# EAGLE design tian_light_rgb_revc (EAGLE 6.1)
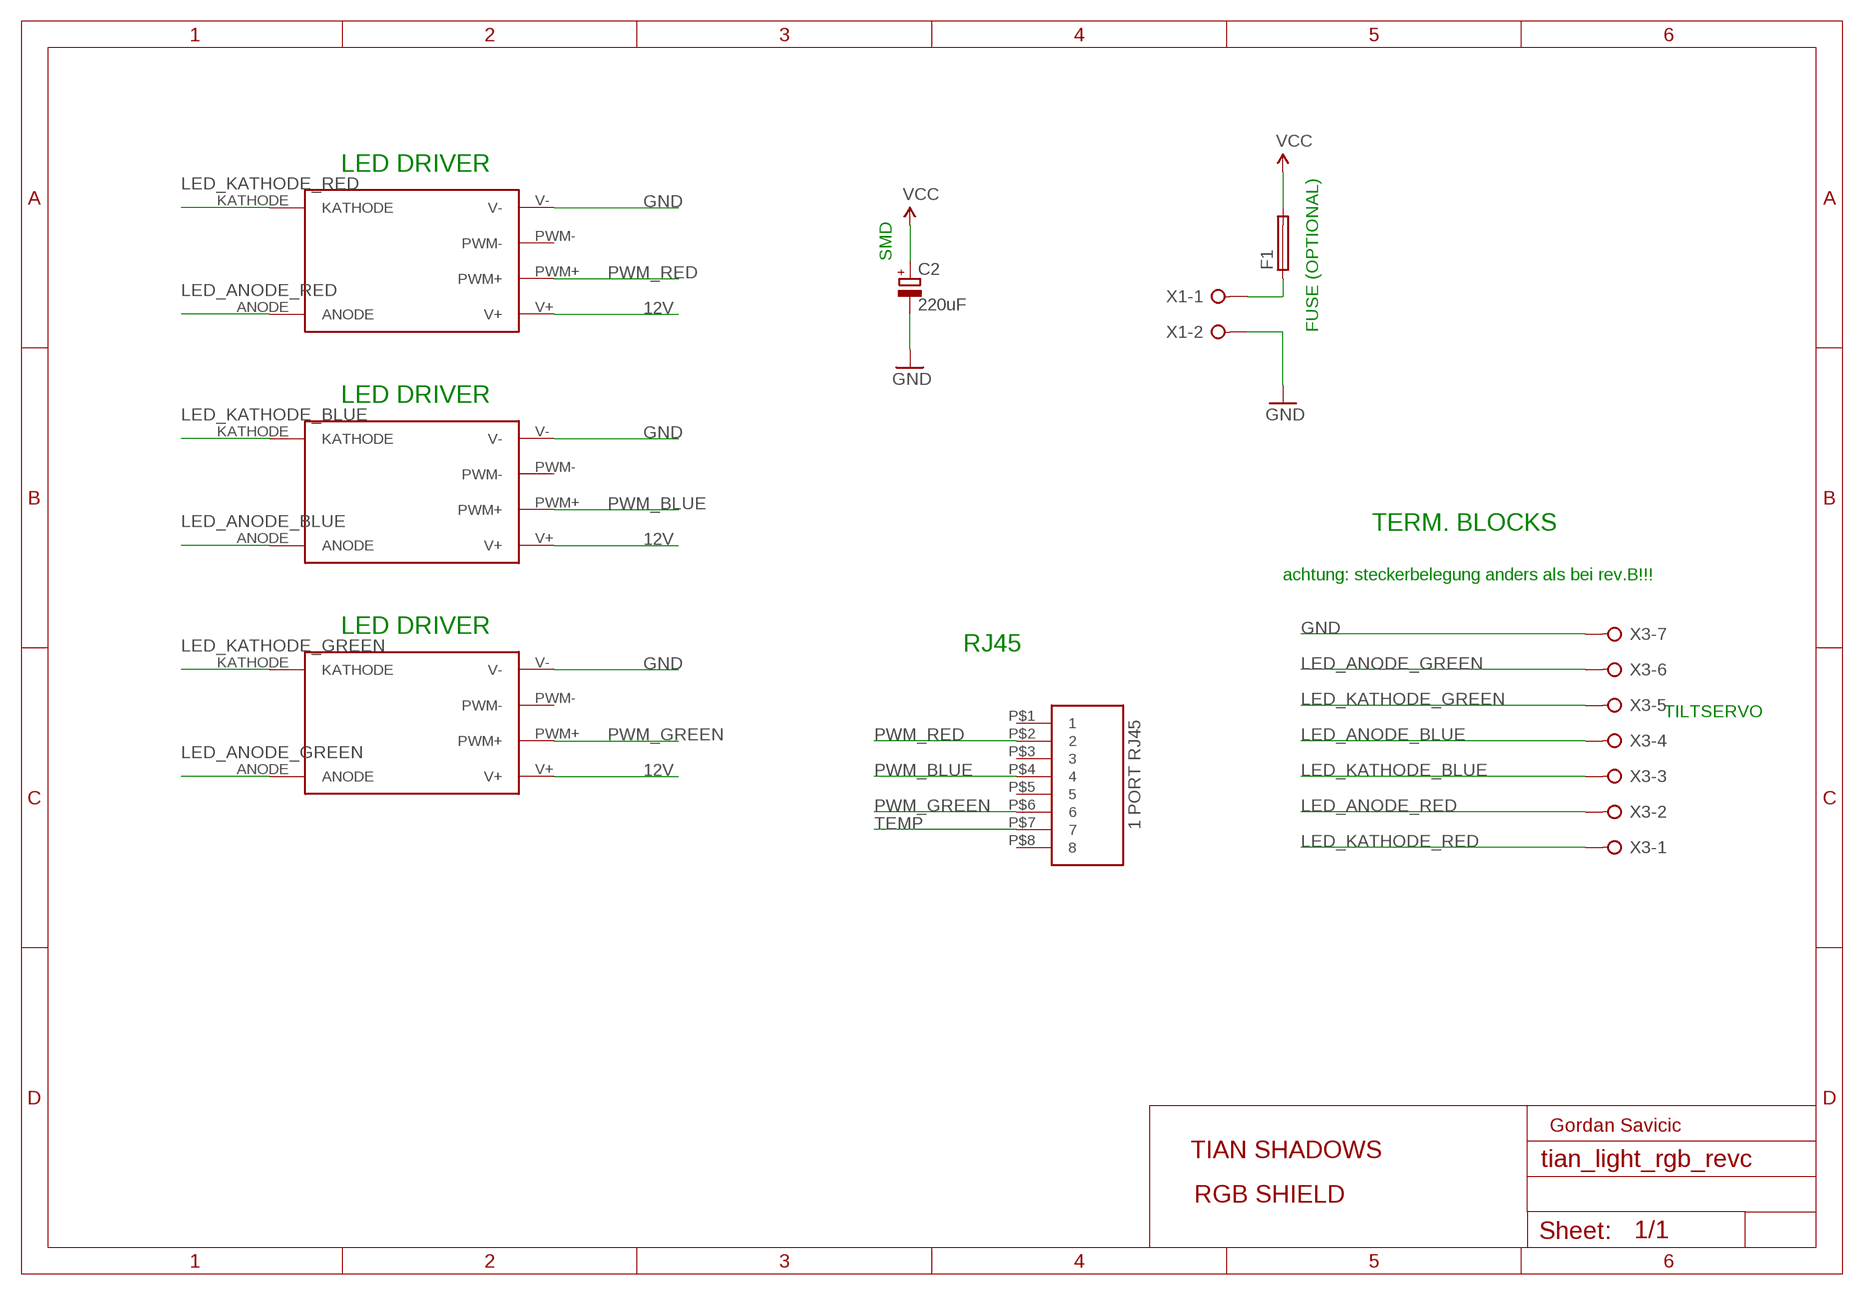
[diagram p0: schematic, sheet 1]

## Parts
C2  220uF  CPOL-EUF  [PANASONIC_F]
F1  SH22,5  [SH22,5]
U$1  BUCK_LED_DRIVER  [BUCK_LED_DRIVER]
U$2  BUCK_LED_DRIVER  [BUCK_LED_DRIVER]
U$3  BUCK_LED_DRIVER  [BUCK_LED_DRIVER]
U$5  1PORT_ETHERNET  [1PORT_ETHERNET]
X1  W237-02P  [W237-132]
X3  W237-07P  [W237-7P]

## Nets
12V: C2.+ F1.2 U$1.V+ U$2.V+ U$3.V+ ; supply symbol labelled VCC
GND: C2.- U$1.V- U$2.V- U$3.V- X1.2 X3.7
LED_ANODE_BLUE: U$2.ANODE X3.4
LED_ANODE_GREEN: U$3.ANODE X3.6
LED_ANODE_RED: U$1.ANODE X3.2
LED_KATHODE_BLUE: U$2.KATHODE X3.3
LED_KATHODE_GREEN: U$3.KATHODE X3.5
LED_KATHODE_RED: U$1.KATHODE X3.1
N$1: F1.1 X1.1
PWM_BLUE: U$2.PWM+ U$5.P$4
PWM_GREEN: U$3.PWM+ U$5.P$6
PWM_RED: U$1.PWM+ U$5.P$2
TEMP: U$5.P$7
Unconnected: U$1.PWM- U$2.PWM- U$3.PWM- U$5.P$1 U$5.P$3 U$5.P$5 U$5.P$8

## Notes on the sheet
- LED DRIVER
- SMD
- FUSE (OPTIONAL)
- LED DRIVER
- TERM. BLOCKS
- achtung: steckerbelegung anders als bei rev.B!!!
- LED DRIVER
- RJ45
- TILTSERVO
- Gordan Savicic
- TIAN SHADOWS
- RGB SHIELD

## Library data of the parts
C2 = rcl:CPOL-EU: POLARIZED CAPACITOR, European symbol
F1 = fuse:SH22,5: FUSE HOLDER grid 22,5 mm, OGN0031 8201, Schurter (Buerklin); MF: SCHURTER; MPN: 0031.8201; OC_FARNELL: 1162740; OC_NEWARK: 96F8317
U$1-U$3 = tian:BUCK_LED_DRIVER
U$5 = strukt:1PORT_ETHERNET
X1 = con-wago-508:W237-02P: WAGO SREW CLAMP; OC_FARNELL: unknown; OC_NEWARK: unknown
X3 = con-wago-508:W237-07P: WAGO SREW CLAMP; OC_FARNELL: unknown; OC_NEWARK: unknown

## Board
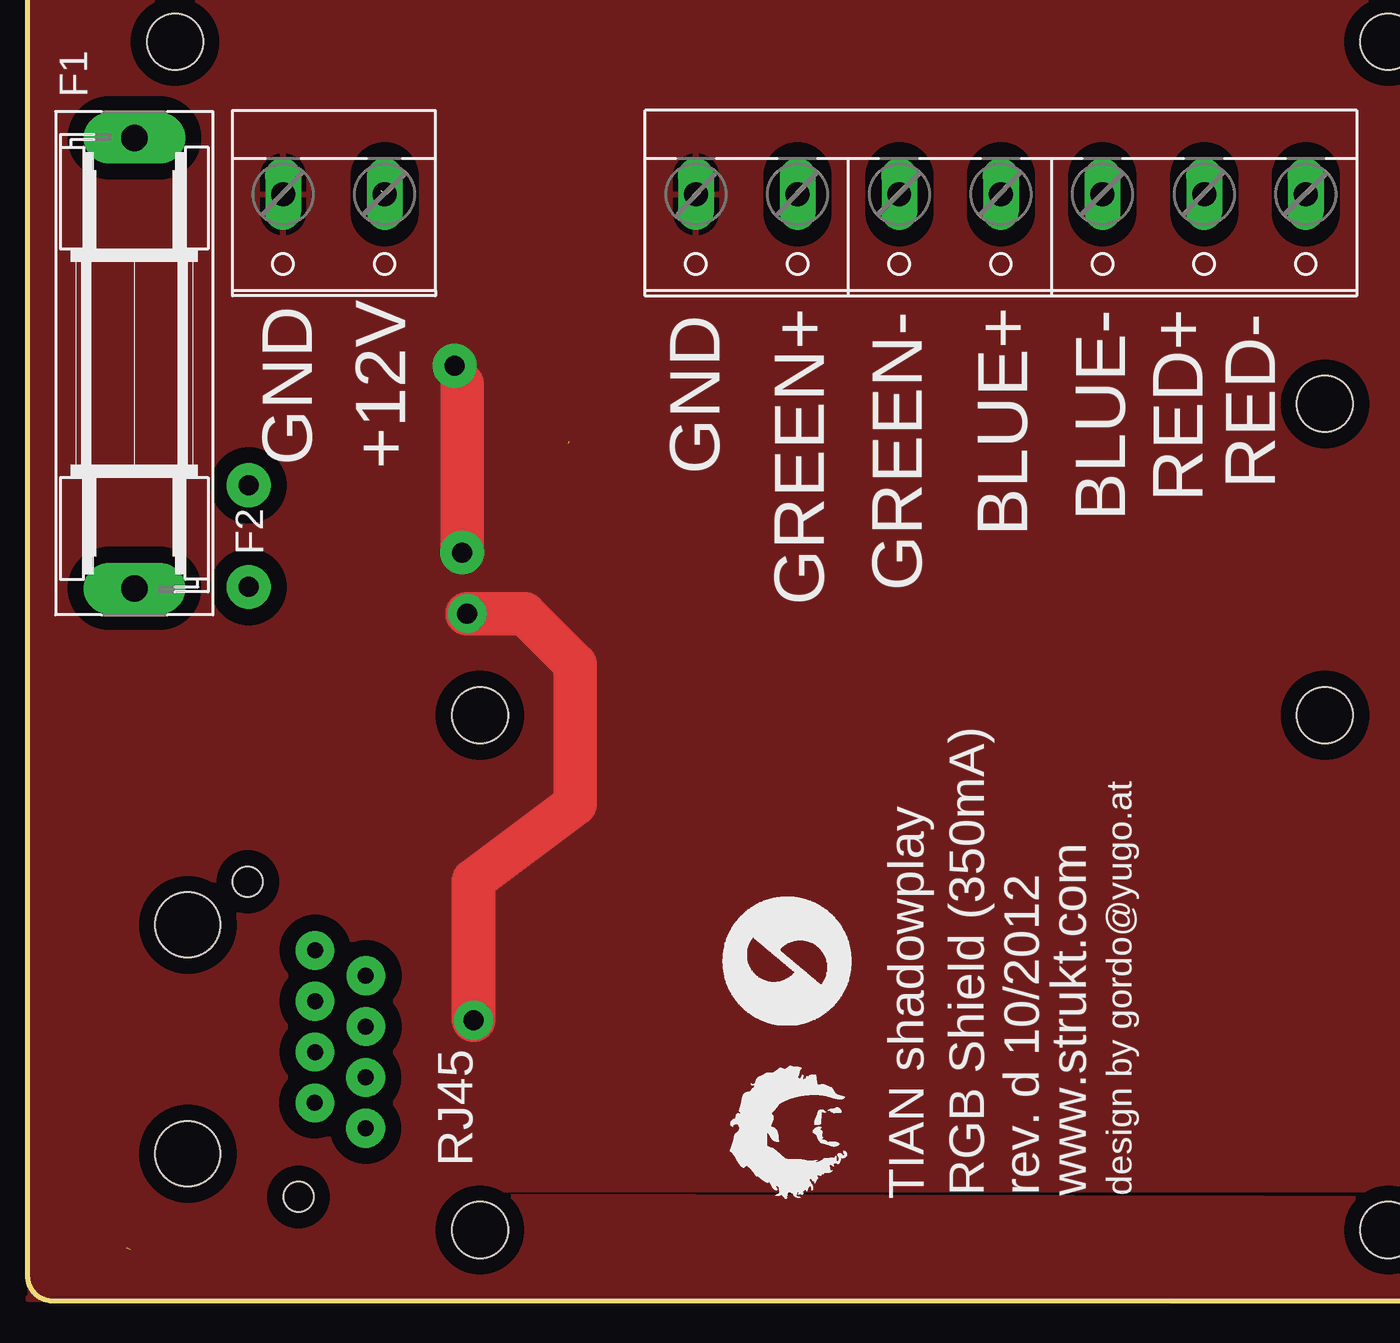
[diagram p1: board, top side]
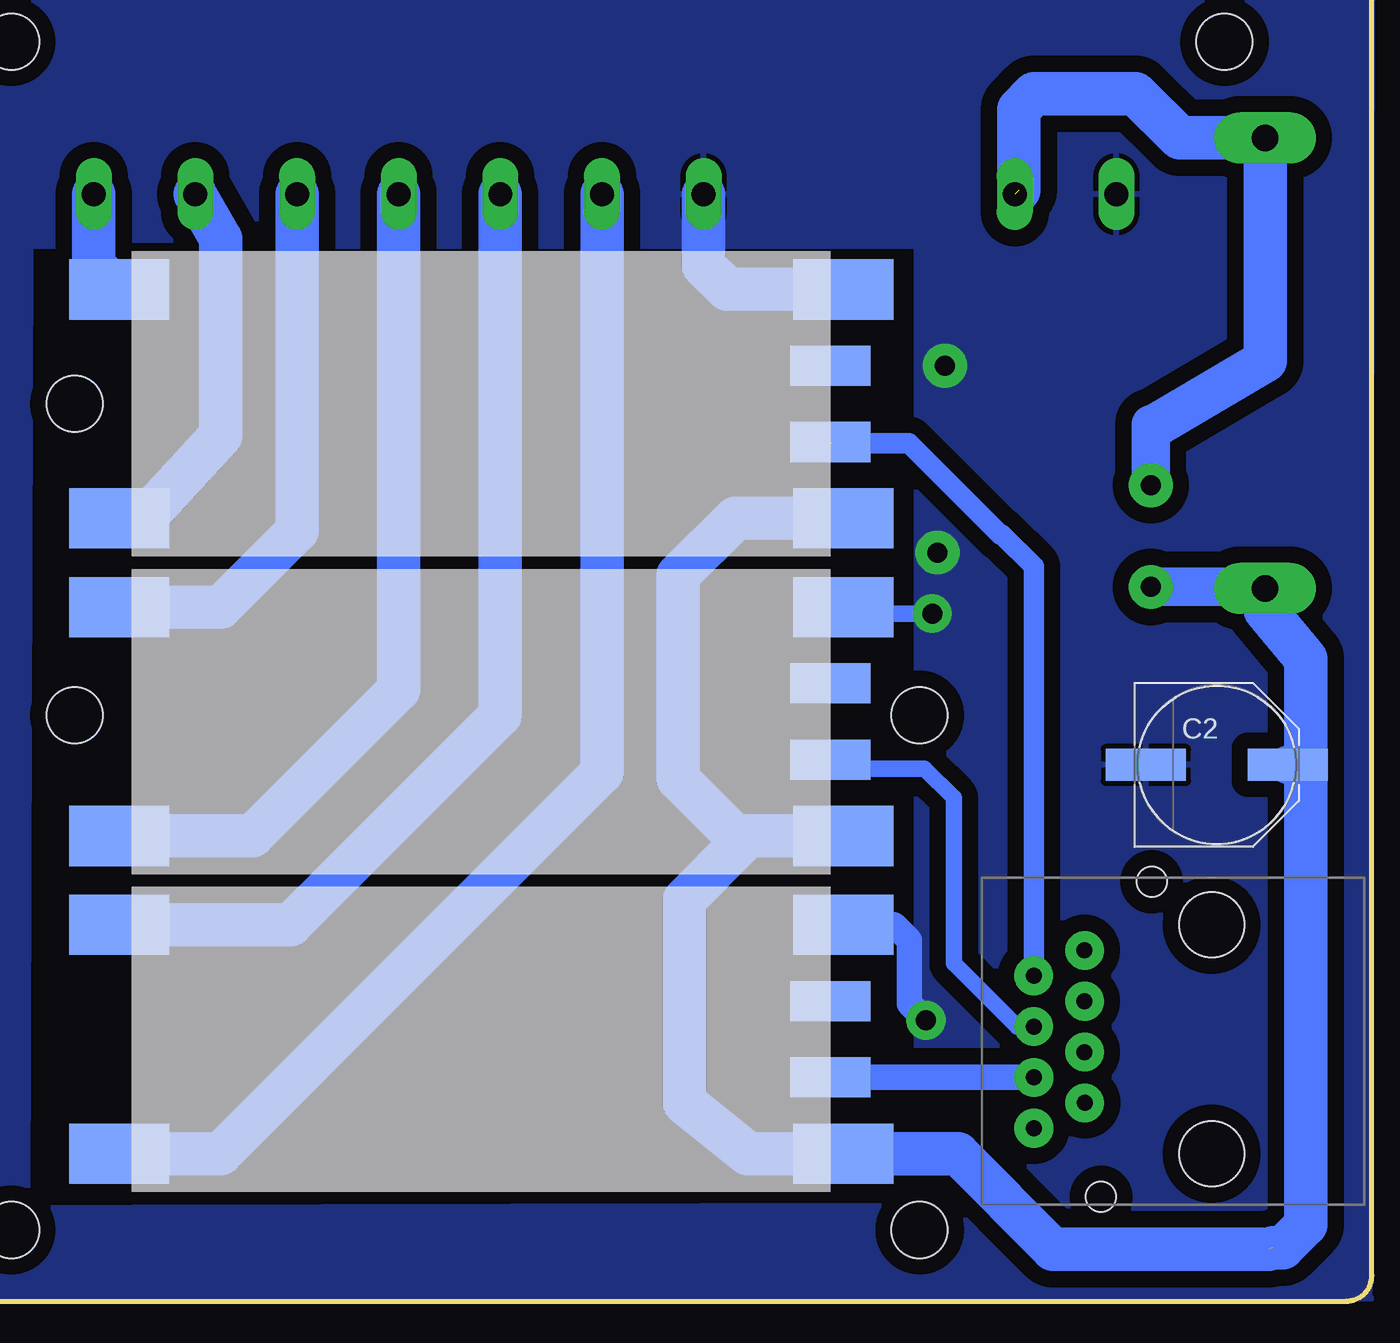
[diagram p2: board, bottom side, seen from below]

No outline drawn. Coordinates in mm, seen from the top.
Copper layers (1*16): Top 0.035mm / dielectric 1.5mm / Bottom 0.035mm
Design rules: minimum track width 8mil, minimum drill 20mil, track to track 8mil, track to pad 8mil, pad to pad 8mil, via to via 8mil, smd to smd 8mil, copper to edge 10mil, drill to drill 8mil, minimum pad ring 12mil, minimum via ring 10mil, stop-mask expansion 4mil, vias tented up to drill 25mil, thermal gap 10mil
Holes 2.8 mm at 65.09,62.55 4.45,62.55 65.09,3.17 61.91,28.89 61.91,44.45 19.68,28.89 19.68,3.17
Milling: 9 lines

### Footprints (pad centres in the part's own frame; a part is rotated, then mirrored left to right if it is on the bottom)
PANASONIC_F = smd 4 x 1.6: + 3.55,0; - -3.55,0
SH22,5 = drill 1.321 pad 2.54 long: 1 -11.252,0; 2 11.252,0
BUCK_LED_DRIVER = smd 5 x 3: ANODE -0.635,1.905; KATHODE -0.635,13.335; V+ 35.56,1.905; V- 35.56,13.335 | smd 4 x 2: PWM+ 34.925,5.715; PWM- 34.925,9.525
1PORT_ETHERNET = drill 0.8 pad 1.93: P$1 -3.82,3.81; P$2 -6.36,2.54; P$3 -3.82,1.27; P$4 -6.36,0; P$5 -3.82,-1.27; P$6 -6.35,-2.54; P$7 -3.81,-3.81; P$8 -6.35,-5.08 | hole 3.25: 2.54,-6.35; 2.54,5.08 | hole 1.5: -3,-8.51; -0.46,7.24
W237-132 = drill 1.194 long: 1 -2.54,-0.635; 2 2.54,-0.635
W237-7P = drill 1.194 long: 1 -15.24,-0.635; 2 -10.16,-0.635; 3 -5.08,-0.635; 4 0,-0.635; 5 5.08,-0.635; 6 10.16,-0.635; 7 15.24,-0.635

### Placement (x,y rotation side)
C2  4.83,26.42 0 bottom
F1  2.41,46.48 270 top
U$1  59.05,36.83 0 bottom
U$2  59.05,20.95 0 bottom
U$3  59.05,5.08 0 bottom
U$5  7.62,13.34 0 bottom
X1  12.38,54.29 180 top
X3  45.72,54.29 180 top

### Tracks (layer width: path | path; a pad name or v marks a point on that pad's centre or on a via)
12V  (1 unrouted)
  Bottom 1.676: U$3.V+ 25.08,6.99 | 25.72,22.86 23.81,22.86 U$2.V+ | U$1.V+ 26.04,38.73
  Bottom 1.93: 28.57,22.54 28.26,22.86 | 23.81,22.86 23.81,23.18 | C2.+ 0.38,26.42
  Bottom 2.184: 2.22,2.22 13.02,2.22 17.78,6.99 U$3.V+ | 25.08,6.99 28.26,6.99 31.43,9.53 31.43,19.68 28.57,22.54 31.75,25.72 31.75,35.88 28.89,38.73 26.04,38.73 | 28.26,22.86 23.81,22.86 | 2.95,35.08 F1.2 2.41,34.14 0.38,31.73 0.38,26.42 0.38,3.43 1.52,2.29 2.03,2.29
GND  (via drill 1 pad 1.93, 1 pad 2.18)
  Top 1.93: 18.8,45.47 v18.41,46.35
  Top 2.184: v18.8,37.02 18.8,45.47 | v19.37,13.65 19.37,20.64 24.45,24.45 24.45,31.43 21.91,33.97 v19.05,33.97
  Bottom 0.813: v19.05,33.97 23.18,33.97 U$2.V-
  Bottom 1.27: U$3.V- 20.95,18.41 20.19,17.65 20.19,14.48 v19.37,13.65
  Bottom 2.184: X3.7 30.48,51.36 29.29,50.16 U$1.V-
  pour Bottom (isolate 0.813): -2.92,-0.25 68.45,-0.38 68.53,4.28 21.16,4.41 21.08,6.86 19.81,6.86 19.81,52.32 64.14,52.32 64.29,4.64 68.47,4.67 68.2,65.53 -2.92,65.66 -2.79,-0.13
  pour Top (isolate 0.813): -2.92,-0.25 68.45,-0.38 68.33,4.7 20.95,4.83 21.08,6.86 21.34,6.86 21.21,5.21 68.07,5.21 68.2,5.33 68.07,65.53 -2.92,65.66 -2.79,-0.13
LED_ANODE_BLUE
  Bottom 2.184: U$2.ANODE 53.02,22.86 45.72,30.16 X3.4
LED_ANODE_GREEN
  Bottom 2.184: U$3.ANODE 54.61,6.99 35.56,26.04 X3.6
LED_ANODE_RED
  Bottom 1.93: U$1.ANODE 58.42,38.73
  Bottom 2.184: 58.42,38.73 54.61,42.86 54.61,52.7 X3.2
LED_KATHODE_BLUE
  Bottom 2.184: X3.3 50.8,38.1 54.61,34.29 U$2.KATHODE
LED_KATHODE_GREEN
  Bottom 2.184: U$3.KATHODE 51.12,18.41 40.64,28.89 X3.5
LED_KATHODE_RED
  Bottom 1.676: U$1.KATHODE 59.69,50.48 60.96,51.75
  Bottom 2.184: 60.96,51.75 X3.1
N$1  (1 unrouted)
  Bottom 2.184: 14.73,55.12 14.73,59.18 13.97,59.94 8.89,59.94 6.68,57.73 F1.1 2.41,46.61 7.7,43.48
N$2  (via drill 1 pad 2.18)
  Bottom 1.93: v8.13,35.31 2.54,35.31
N$3  (via drill 1 pad 2.18)
  Bottom 1.93: v8.13,40.39 8.13,43.43
PWM_BLUE
  Bottom 0.406: 17.97,16.57 17.97,16.51
  Bottom 0.813: 17.97,16.57 17.97,24.77 19.43,26.23 23.69,26.23 U$2.PWM+ | 17.97,16.51 14.8,13.34 U$5.P$4
PWM_GREEN
  Bottom 1.27: U$3.PWM+ 16.19,10.79 U$5.P$6
PWM_RED  (1 unrouted)
  Bottom 1.016: U$5.P$2 13.98,36.33 15.57,37.92 15.65,37.92 20.22,42.49 24.11,42.49

### Text on the board
tPlace: F1 | RED- | GND | +12V | GND | RED+ | F2 | BLUE- | BLUE+ | GREEN- | GREEN+ | RJ45 | TIAN shadowplay | RGB Shield (350mA) | rev. d 10/2012 | www.strukt.com | design by gordo@yugo.at